# Altium schematic sheet Flowmeter.SchDoc
size A; SheetNumber: 7; SheetTotal: 15
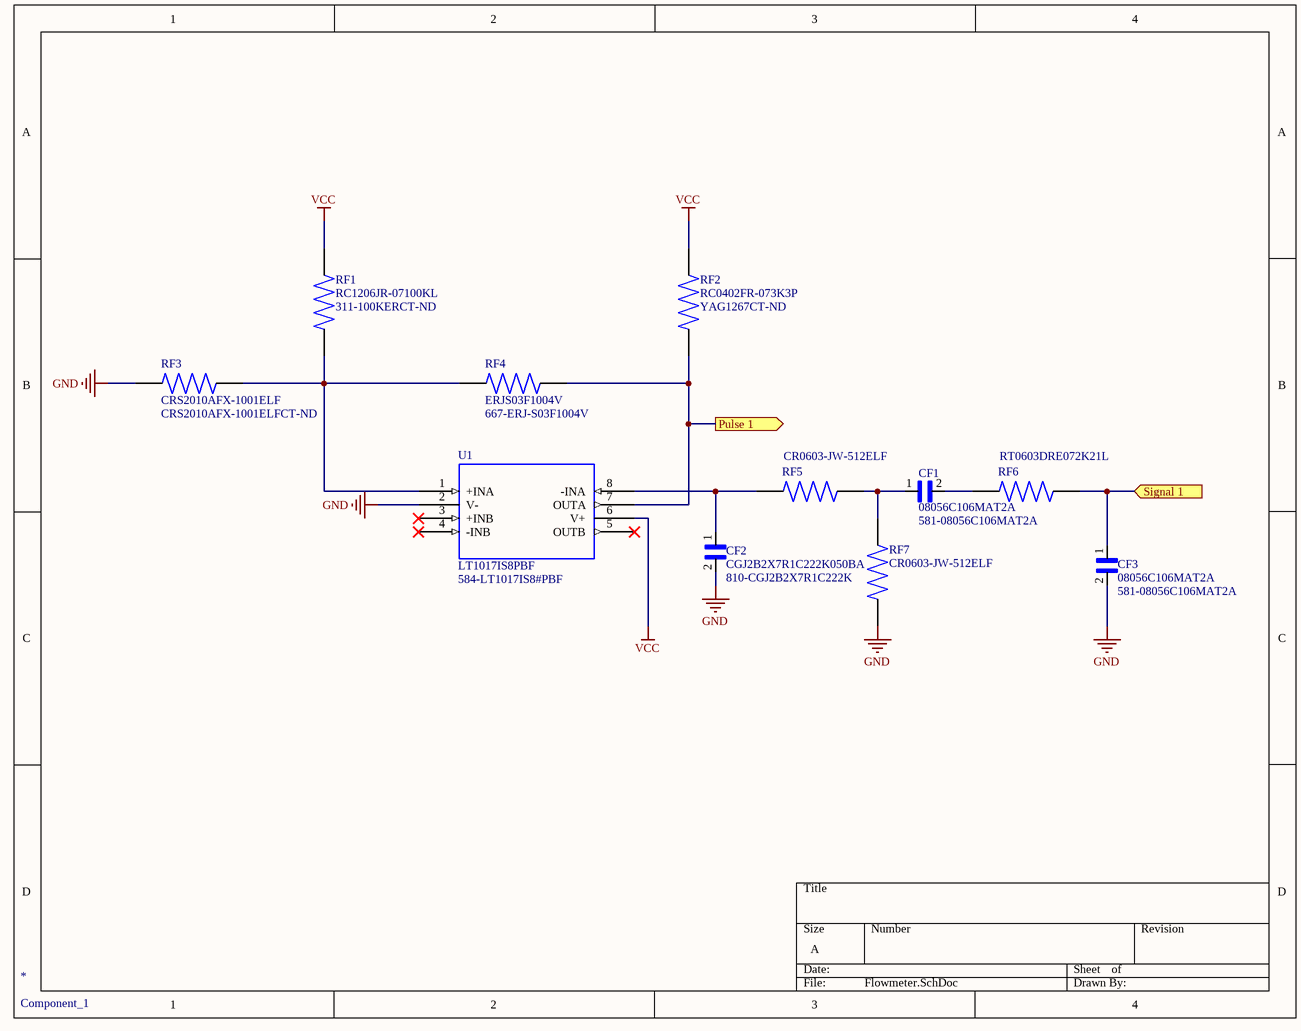
[diagram p0: Flowmeter.SchDoc]

## Parts
*  Component_1
CF1  08056C106MAT2A  Supplier Part Number 1: 581-08056C106MAT2A  [CAPC2012X152N]
CF2  CGJ2B2X7R1C222K050BA  Supplier Part Number 1: 810-CGJ2B2X7R1C222K  [CAPC1005X55N]
CF3  08056C106MAT2A  Supplier Part Number 1: 581-08056C106MAT2A  [CAPC2012X152N]
RF1  RC1206JR-07100KL  Supplier Part Number 1: 311-100KERCT-ND  [RESC3116X65N]
RF2  RC0402FR-073K3P  Supplier Part Number 1: YAG1267CT-ND  [RESC1005X40N]
RF3  CRS2010AFX-1001ELF  Supplier Part Number 1: CRS2010AFX-1001ELFCT-ND  [RESC5025X70N]
RF4  ERJS03F1004V  Supplier Part Number 1: 667-ERJ-S03F1004V  [RES_ERJS03F1004V]
RF5  CR0603-JW-512ELF  [RESC1608X55N]
RF6  RT0603DRE072K21L  [RESC1608X55N]
RF7  CR0603-JW-512ELF  [RESC1608X55N]
U1  LT1017IS8PBF  Supplier Part Number 1: 584-LT1017IS8#PBF  [SO-8_S]

## Ports
Pulse 1 (out), Signal 1 (in)

## Nets
GND: CF2.2 CF3.2 RF3.1 RF7.2 U1.2(V-)
VCC: RF1.1 RF2.1 U1.6(V+)
Pulse 1: RF2.2 RF4.2 U1.7(OUTA) ; port Pulse 1
Signal 1: CF3.1 RF6.2 ; port Signal 1
NetCF1_1: CF1.1 RF5.2 RF7.1
NetCF1_2: CF1.2 RF6.1
NetCF2_1: CF2.1 RF5.1 U1.8(-INA)
NetRF1_2: RF1.2 RF3.2 RF4.1 U1.1(+INA)

Not connected (* = marked no-connect by the designer): U1 3(+INB)* 4(-INB)* 5(OUTB)*

## Library data of the parts
CF1 CF3 = 08056C106MAT2A: 0805 10 uF 6.3 V Â±20 % Tolerance X7R SMT Multilayer Ceramic Capacitor; Package: None; Price: None; Value: *; MP: 08056C106MAT2A; Availability: Unavailable; Supplier 1: Mouser
CF2 = CGJ2B2X7R1C222K050BA: High Reliability - Autograde Plus+, Reel Size: 7" (180mm); Package: None; Price: None; Value: *; MP: CGJ2B2X7R1C222K050BA; Availability: Unavailable; Supplier 1: Mouser
RF1 = RC1206JR-07100KL: Carbon film resistor 100 kâ„¦ SMD 1206 0.25 W 5 % 200 ppm Yageo RC1206JR-07100KL 1 pc(s); Package: None; Price: None; Value: *; MP: RC1206JR-07100KL; Availability: Unavailable; Supplier 1: Digi-Key
RF2 = RC0402FR-073K3P: Chip Resistor Surface Mount; Package: None; Price: None; Value: *; MP: RC0402FR-073K3P; Availability: Unavailable; Supplier 1: Digi-Key
RF4 = ERJS03F1004V: Res Thick Film 0603 1M Ohm 1% 0.1W(1/10W) Â±100ppm/Â°C Sulfur Resistant Pad SMD Automotive T/R; MP: ERJ-S03F1004V; MF: Panasonic; Availability: Not in stock; Value: *; Price: None; SnapEDA_Link: https://www.snapeda.com/parts/ERJ-S03F1004V/Panasonic/view-part/3733497/?ref=snap; Check_prices: https://www.snapeda.com/parts/ERJ-S03F1004V/Panasonic/view-part/3733497/?ref=eda; Package: 1608-2 Panasonic; Supplier 1: Mouser
RF5 RF7 = CR0603-JW-512ELF: Resistor Thick Film 0603 5.1k Ohm 5% 1/10 Watt Â±200ppm Â°C Surface Mount Paper Tape On Plastic Reel; Package: None; Price: None; Value: *; MP: CR0603-JW-512ELF; Availability: Unavailable; Supplier 1: Digi-Key; Supplier Part Number 1: 118-CR0603-JW-512ELFCT-ND
RF6 = RT0603DRE072K21L: RES SMD 2.21KOHM 0.5% 1/10W 0603; Package: None; Price: None; Value: *; MP: RT0603DRE072K21L; Availability: Unavailable
U1 = LT1017IS8PBF: Comparator General Purpose Pull Up 8-SOIC; MF: Analog Devices; MP: LT1017IS8#PBF; Purchase-URL: https://pricing.snapeda.com/search/part/LT1017IS8#PBF/?ref=eda; Check_prices: https://www.snapeda.com/parts/LT1017IS8%23PBF/Analog%20Devices/view-part/4348316/?ref=eda; Value: *; Package: SOIC -8 Analog Devices; Price: None; Availability: In Stock; SnapEDA_Link: https://www.snapeda.com/parts/LT1017IS8%23PBF/Analog%20Devices/view-part/4348316/?ref=snap; Supplier 1: Mouser
RF3 = CRS2010AFX-1001ELF: Package: None; Price: None; Value: *; MP: CRS2010AFX-1001ELF; Availability: Unavailable; Supplier 1: Digi-Key